# Altium schematic sheet mixer.SchDoc
size A4; SheetNumber: 6; SheetTotal: 6
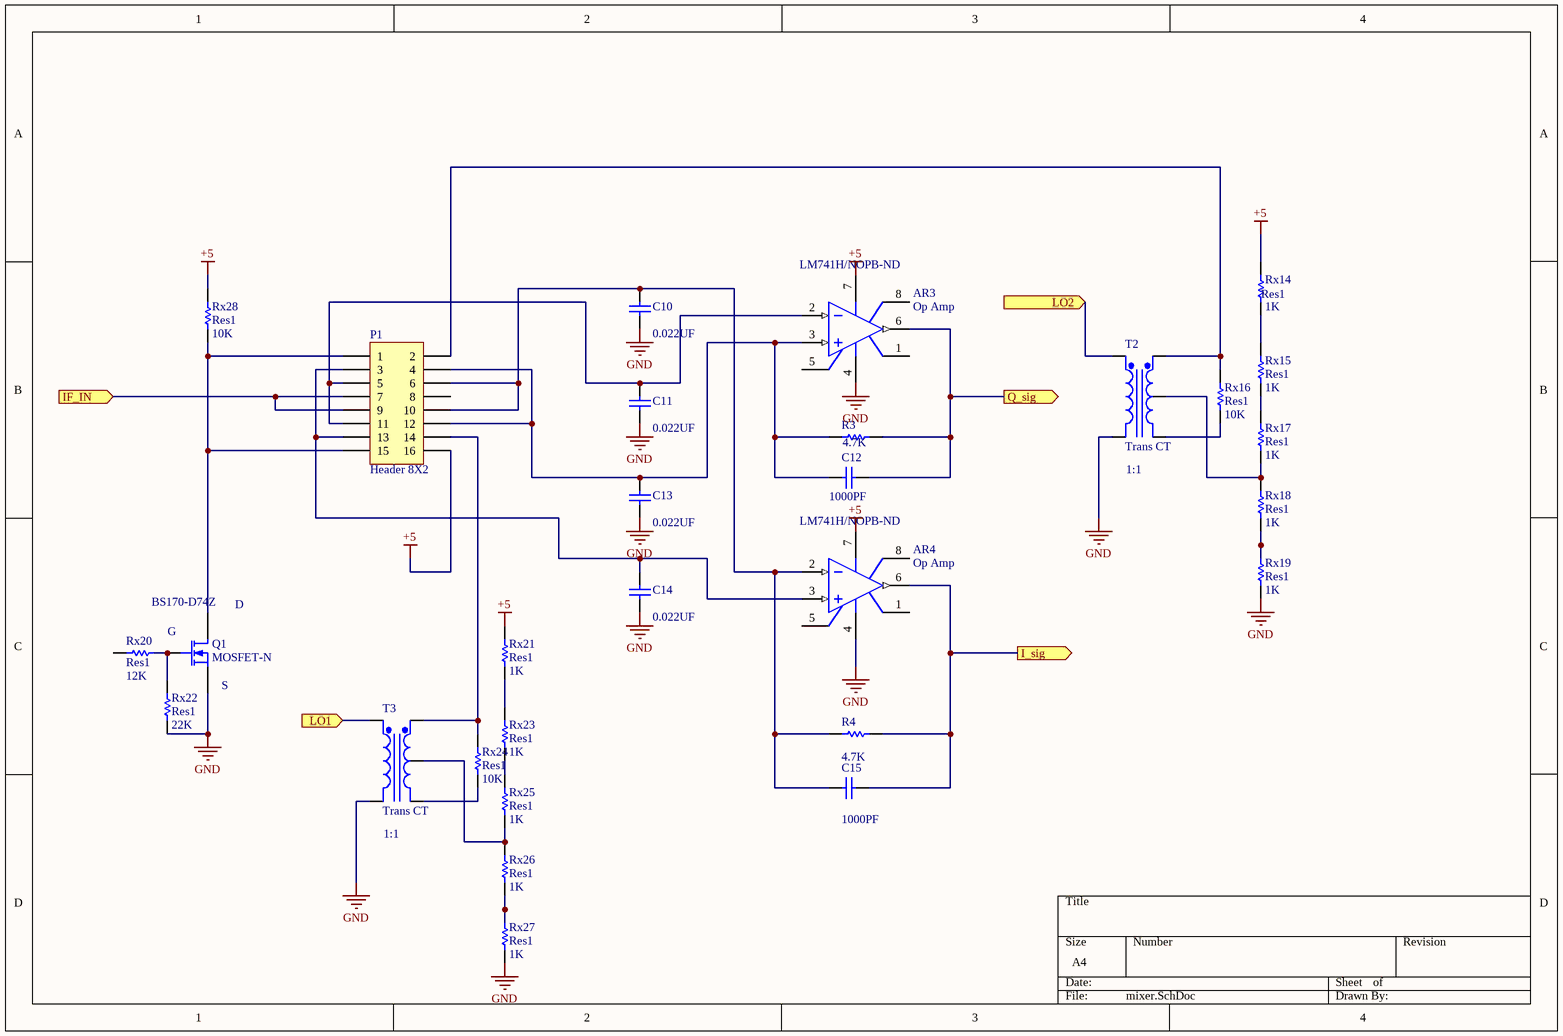
[diagram p0: mixer.SchDoc]

## Parts
AR3  Op Amp  Supplier Part Number 1: LM741H/NOPB-ND  [H-08A]
AR4  Op Amp  Supplier Part Number 1: LM741H/NOPB-ND  [H-08A]
C10  value 0.022UF  [RADIAL-0.1]
C11  value 0.022UF  [RADIAL-0.1]
C12  value 1000PF  [RADIAL-0.1]  (hidden comment: Cap)
C13  value 0.022UF  [RADIAL-0.1]  (hidden comment: Cap)
C14  value 0.022UF  [RADIAL-0.1]  (hidden comment: Cap)
C15  value 1000PF  [RADIAL-0.1]  (hidden comment: Cap)
P1  Header 8X2  [HDR2X8]
Q1  MOSFET-N  Supplier Part Number 1: BS170-D74Z  [E3]
R3  value 4.7K  [AXIAL-0.1-RES]  (hidden comment: Res1)
R4  value 4.7K  [AXIAL-0.1-RES]  (hidden comment: Res1)
Rx14  Res1  value 1K  [AXIAL-0.1-RES]
Rx15  Res1  value 1K  [AXIAL-0.1-RES]
Rx16  Res1  value 10K  [AXIAL-0.1-RES]
Rx17  Res1  value 1K  [AXIAL-0.1-RES]
Rx18  Res1  value 1K  [AXIAL-0.1-RES]
Rx19  Res1  value 1K  [AXIAL-0.1-RES]
Rx20  Res1  value 12K  [AXIAL-0.1-RES]
Rx21  Res1  value 1K  [AXIAL-0.1-RES]
Rx22  Res1  value 22K  [AXIAL-0.1-RES]
Rx23  Res1  value 1K  [AXIAL-0.1-RES]
Rx24  Res1  value 10K  [AXIAL-0.1-RES]
Rx25  Res1  value 1K  [AXIAL-0.1-RES]
Rx26  Res1  value 1K  [AXIAL-0.1-RES]
Rx27  Res1  value 1K  [AXIAL-0.1-RES]
Rx28  Res1  value 10K  [AXIAL-0.1-RES]
T2  Trans CT  [BIFILAR-2402]
T3  Trans CT  [BIFILAR-2402]

## Ports
I_sig (out), IF_IN (in), LO1 (in), LO2 (in), Q_sig (out)

## Nets
+5: AR3.7(V+) AR4.7(V+) P1.16 Rx14.2 Rx21.2 Rx28.2
GND: AR3.4(V-) AR4.4(V-) C10.1 C11.1 C13.1 C14.1 Q1.3(S) Rx19.1 Rx22.1 Rx27.1 T2.5(Pri-) T3.5(Pri-)
I_sig: AR4.6(OUT) C15.2 R4.2 ; port I_sig
IF_IN: P1.7 P1.9 ; port IF_IN
LO1: T3.4(Pri+) ; port LO1
LO2: T2.4(Pri+) ; port LO2
Q_sig: AR3.6(OUT) C12.2 R3.2 ; port Q_sig
NetAR3_2: AR3.2(IN-) C11.2 P1.5 P1.11
NetAR3_3: AR3.3(IN+) C12.1 C13.2 P1.4 P1.12 R3.1
NetAR4_2: AR4.2(IN-) C10.2 C15.1 P1.6 P1.10 R4.1
NetAR4_3: AR4.3(IN+) C14.2 P1.3 P1.13
NetP1_1: P1.1 P1.15 Q1.1(D) Rx28.1
NetP1_2: P1.2 Rx16.2 T2.1(Sec+)
NetP1_14: P1.14 Rx24.2 T3.1(Sec+)
NetQ1_2: Q1.2(G) Rx20.2 Rx22.2
NetRx14_1: Rx14.1 Rx15.2
NetRx15_1: Rx15.1 Rx17.2
NetRx16_1: Rx16.1 T2.3(Sec-)
NetRx17_1: Rx17.1 Rx18.2 T2.2(SecCT)
NetRx18_1: Rx18.1 Rx19.2
NetRx21_1: Rx21.1 Rx23.2
NetRx23_1: Rx23.1 Rx25.2
NetRx24_1: Rx24.1 T3.3(Sec-)
NetRx25_1: Rx25.1 Rx26.2 T3.2(SecCT)
NetRx26_1: Rx26.1 Rx27.2

Not connected (* = marked no-connect by the designer): AR3 1(OS_NUL) 5(OS_NUL) 8(TAB); AR4 1(OS_NUL) 5(OS_NUL) 8(TAB); P1 8; Rx20 1

## Notes on the sheet
- (near T2) 1:1
- (near Q1) G
- (near Q1) D
- (near Q1) S
- (near T3) 1:1

## Library data of the parts
AR3 AR4 = Op Amp: FET Operational Amplifier; Published: 8-Jun-2000; LatestRevisionDate: 17-Jul-2002; LatestRevisionNote: Re-released for DXP Platform.; DatasheetVersion: REV. B; PackageVersion: 1990; PackageReference: H-08A; Publisher: Altium Limited; PackageDescription: Can; 8 Leads; Pin Circle Dia. 5.08 mm; Lead Dia. 0.53 mm (max); ComponentLink1Description: Manufacturer Link; ComponentLink1URL: http://www.analog.com/; Supplier 1: Digi-Key
C10 C11 C13 C14 = CAP CER 0.022UF 50V X7R RADIAL: Capacitor; Manufacturer Part Number: C315C223K5R5TA7303; Designator: C?; Voltage Rating: 50V; Published: 8-Jun-2000; LatestRevisionDate: 17-Jul-2002; LatestRevisionNote: Re-released for DXP Platform.; Publisher: Altium Limited
C12 C15 = CAP CER 1000PF 50V Z5U RADIAL: Capacitor; Manufacturer Part Number: C315C102M5U5TA; Designator: C?; Voltage Rating: 50V; Published: 8-Jun-2000; LatestRevisionDate: 17-Jul-2002; LatestRevisionNote: Re-released for DXP Platform.; Publisher: Altium Limited
P1 = Header 8X2: Header, 8-Pin, Dual row; LatestRevisionDate: 17-Jul-2002; LatestRevisionNote: Re-released for DXP Platform.; Publisher: Altium Limited
Q1 = MOSFET-N: N-Channel MOSFET; Published: 8-Jun-2000; LatestRevisionDate: 17-Jul-2002; LatestRevisionNote: Re-released for DXP Platform.; PackageVersion: 1995/1996; PackageReference: E3; Publisher: Altium Limited; PackageDescription: TO, Flat Index; 3 In-Line, Axial Leads; Body Dia. 4.6mm; Lead Dia. 0.5 mm (max); Supplier 1: Avnet
R3 R4 = RES 4.7K OHM 5% 1/4W AXIAL: Resistor; Manufacturer Part Number: CFR-25JB-52-4K7; Designator: R?; Power Rating: 1/4W; Tolerance: 0.05; Published: 8-Jun-2000; LatestRevisionDate: 17-Jul-2002; LatestRevisionNote: Re-released for DXP Platform.; Publisher: Altium Limited
Rx14 Rx15 Rx17-Rx19 Rx21 Rx23 Rx25-Rx27 = RES 1K OHM 5% 1/4W AXIAL: Resistor; Manufacturer Part Number: CFR-25JB-52-1K; Designator: R?; Power Rating: 1/4W; Tolerance: 0.05; Published: 8-Jun-2000; LatestRevisionDate: 17-Jul-2002; LatestRevisionNote: Re-released for DXP Platform.; Publisher: Altium Limited
Rx16 Rx24 Rx28 = RES 10K OHM 5% 1/4W AXIAL: Resistor; Manufacturer Part Number: CFR-25JB-52-10K; Designator: R?; Power Rating: 1/4W; Tolerance: 0.05; Published: 8-Jun-2000; LatestRevisionDate: 17-Jul-2002; LatestRevisionNote: Re-released for DXP Platform.; Publisher: Altium Limited
Rx20 = RES 12K OHM 5% 1/4W AXIAL: Resistor; Manufacturer Part Number: CFR-25JB-52-12K; Designator: R?; Power Rating: 1/4W; Tolerance: 0.05; Published: 8-Jun-2000; LatestRevisionDate: 17-Jul-2002; LatestRevisionNote: Re-released for DXP Platform.; Publisher: Altium Limited
Rx22 = RES 22K OHM 5% 1/4W AXIAL: Resistor; Manufacturer Part Number: CFR-25JB-52-22K; Designator: R?; Power Rating: 1/4W; Tolerance: 0.05; Published: 8-Jun-2000; LatestRevisionDate: 17-Jul-2002; LatestRevisionNote: Re-released for DXP Platform.; Publisher: Altium Limited
T2 T3 = Centre-tapped transformer wound on a binocular core: Center-Tapped Transformer (Coupled Inductor Model); Designator: T?; Published: 8-Jun-2000; LatestRevisionDate: 17-Jul-2002; LatestRevisionNote: Re-released for DXP Platform.; Publisher: Altium Limited